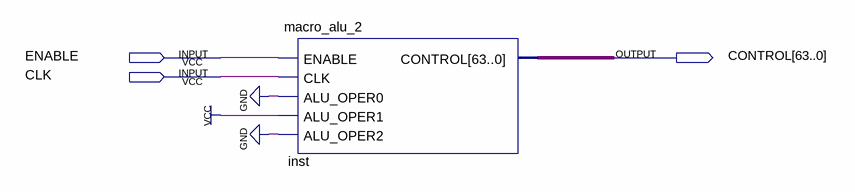
[diagram p0: schematic sheet]
// Quartus schematic macro_alu_nor.bdf as structural Verilog: 1 symbols, 3 pins
module macro_alu_nor (
  input  ENABLE,
  input  CLK,
  output [63:0] CONTROL
);

  macro_alu_2 inst (
    .ENABLE(ENABLE), .CLK(CLK), .ALU_OPER0(1'b0), .ALU_OPER1(1'b1), .ALU_OPER2(1'b0), .CONTROL(CONTROL));
endmodule
